# EAGLE design POVDisplayRotate (EAGLE 7.4.0)
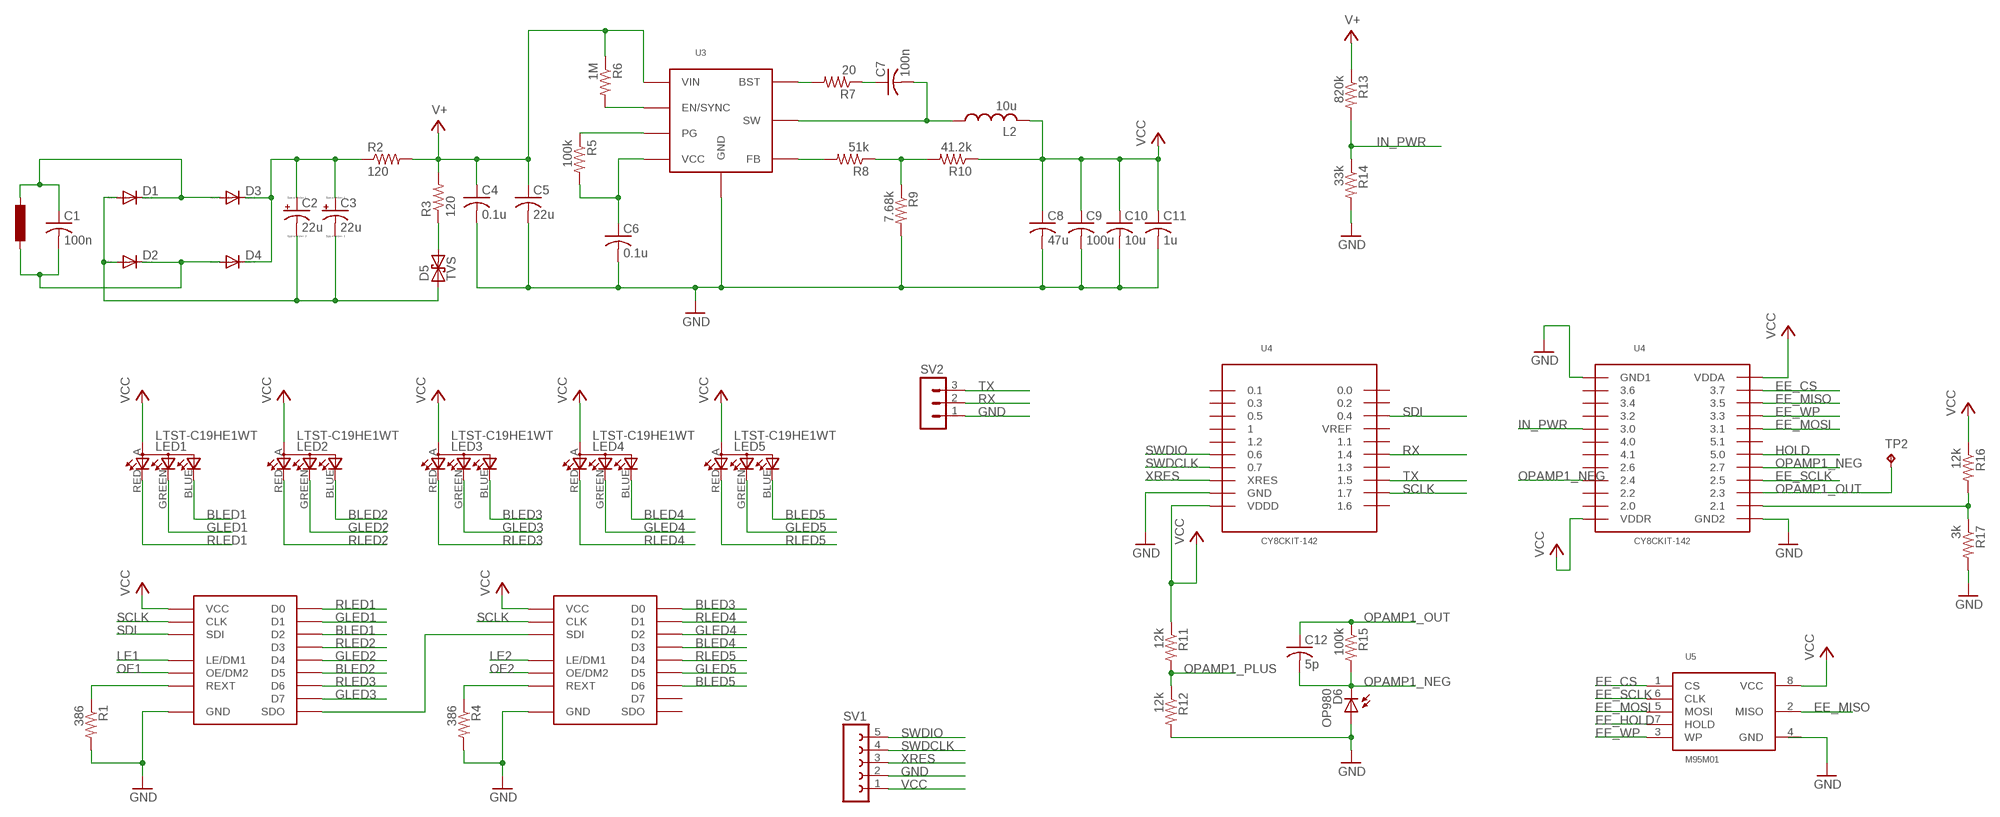
[diagram p0: schematic, sheet 1]

## Parts
C1  100n  C-USC1210  [C1210]
C2  22u  CPOL-USC  [PANASONIC_C]
C3  22u  CPOL-USC  [PANASONIC_C]
C4  0.1u  C-USC0603  [C0603]
C5  22u  C-USC0805  [C0805]
C6  0.1u  C-USC0603  [C0603]
C7  100n  C-USC0603  [C0603]
C8  47u  C-USC0603  [C0603]
C9  100u  C-USC1210  [C1210]
C10  10u  C-USC0603  [C0603]
C11  1u  C-USC0603  [C0603]
C12  5p  C-USC0603  [C0603]
D1  DIODE-SOD123  [SOD123]
D2  DIODE-SOD123  [SOD123]
D3  DIODE-SOD123  [SOD123]
D4  DIODE-SOD123  [SOD123]
D5  TVS  [SMB]
D6  OP980  [PLCC-2]
L2  10u  L-USL1812  [L1812]
LED1  LTST-C19HE1WT  [LTST-C19HE1WT]
LED2  LTST-C19HE1WT  [LTST-C19HE1WT]
LED3  LTST-C19HE1WT  [LTST-C19HE1WT]
LED4  LTST-C19HE1WT  [LTST-C19HE1WT]
LED5  LTST-C19HE1WT  [LTST-C19HE1WT]
R1  386  R-US_R0603  [R0603]
R2  120  R-US_R0603  [R0603]
R3  120  R-US_R0603  [R0603]
R4  386  R-US_R0603  [R0603]
R5  100k  R-US_R0603  [R0603]
R6  1M  R-US_R0603  [R0603]
R7  20  R-US_R0603  [R0603]
R8  51k  R-US_R0603  [R0603]
R9  7.68k  R-US_R0603  [R0603]
R10  41.2k  R-US_R0603  [R0603]
R11  12k  R-US_R0603  [R0603]
R12  12k  R-US_R0603  [R0603]
R13  820k  R-US_R0603  [R0603]
R14  33k  R-US_R0603  [R0603]
R15  100k  R-US_R0603  [R0603]
R16  12k  R-US_R0603  [R0603]
R17  3k  R-US_R0603  [R0603]
SV1  FE05-1  [FE05-1]
SV2  MA03-1  [MA03-1]
TP2  TPB1,27  [B1,27]
U1  STP08DP05  [SSOP16_EPAD]
U2  STP08DP05  [SSOP16_EPAD]
U3  MPQ4420Q  [SOT-23-8]
U4  CY8CKIT-142  [CY8CKIT-142]
U5  M95M01  [SO-08]

## Nets
BLED1: LED1.BLUE(CBLUE) U1.7(D2)
BLED2: LED2.BLUE(CBLUE) U1.10(D5)
BLED3: LED3.BLUE(CBLUE) U2.5(D0)
BLED4: LED4.BLUE(CBLUE) U2.8(D3)
BLED5: LED5.BLUE(CBLUE) U2.11(D6)
DAC_OUT: R16.2 R17.1 U4.2.1
EE_CS: U4.3.7 U5.1(CS)
EE_HOLD: U5.7(HOLD)
EE_MISO: U4.3.5 U5.2(MISO)
EE_MOSI: U4.3.1 U5.5(MOSI)
EE_SCLK: U4.2.5 U5.6(CLK)
EE_WP: U4.3.3 U5.3(WP)
GLED1: LED1.GREEN(CGREEN) U1.6(D1)
GLED2: LED2.GREEN(CGREEN) U1.9(D4)
GLED3: LED3.GREEN(CGREEN) U1.12(D7)
GLED4: LED4.GREEN(CGREEN) U2.7(D2)
GLED5: LED5.GREEN(CGREEN) U2.10(D5)
GND: C4.2 C5.2 C6.2 C8.2 C9.2 C10.2 C11.2 D6.P$1(A) R1.2 R4.2 R9.2 R12.2 R14.2 R17.2 SV1.2 SV2.1 U1.1(GND) U1.GND U2.1(GND) U2.GND U3.4(GND) U4.GND U4.GND1 U4.GND2
HOLD: U4.5.0
IN_PWR: R13.2 R14.1 U4.3.0
LE1: U1.4(LE/DM1)
LE2: U2.4(LE/DM1)
N$1: C6.1 R5.2 U3.7(VCC)
N$2: R6.2 U3.6(EN/SYNC)
N$3: C2.+ C3.+ D3.C D4.C R2.1
N$4: R8.2 U3.8(FB)
N$5: R8.1 R9.1 R10.2
N$6: R1.1 U1.15(REXT)
N$7: R7.2 U3.5(BST)
N$8: C7.1 R7.1
N$10: R4.1 U2.15(REXT)
N$11: D5.C R3.1
N$13: R5.1 U3.1(PG)
N$17: C2.- C3.- D1.A D2.A D5.A
N$18: U1.14(SDO) U2.2(SDI)
NEG_COIL: C1.2 D2.C D4.A
OE1: U1.13(OE/DM2)
OE2: U2.13(OE/DM2)
OPAMP1_NEG: C12.2 D6.P$2(C) R15.2 U4.2.4 U4.2.7
OPAMP1_OUT: C12.1 R15.1 TP2.TP U4.2.3
OPAMP1_PLUS: R11.2 R12.1
POS_COIL: C1.1 D1.C D3.A
RLED1: LED1.RED(CRED) U1.5(D0)
RLED2: LED2.RED(CRED) U1.8(D3)
RLED3: LED3.RED(CRED) U1.11(D6)
RLED4: LED4.RED(CRED) U2.6(D1)
RLED5: LED5.RED(CRED) U2.9(D4)
RX: SV2.2 U4.1.4
SCLK: U1.3(CLK) U2.3(CLK) U4.1.7
SDI: U1.2(SDI) U4.0.4
SWDCLK: SV1.4 U4.0.7
SWDIO: SV1.5 U4.0.6
SWOUT: C7.2 L2.1 U3.3(SW)
TX: SV2.3 U4.1.5
V+: C4.1 C5.1 R2.2 R3.2 R6.1 R13.1 U3.2(VIN)
VCC: C8.1 C9.1 C10.1 C11.1 L2.2 LED1.A LED2.A LED3.A LED4.A LED5.A R10.1 R11.1 R16.1 SV1.1 U1.16(VCC) U2.16(VCC) U4.VDDA U4.VDDD U4.VDDR U5.8(VCC)
XRES: SV1.3 U4.XRES
Unconnected: U2.12(D7) U2.14(SDO) U4.0.0 U4.0.1 U4.0.2 U4.0.3 U4.0.5 U4.1 U4.1.1 U4.1.2 U4.1.3 U4.1.6 U4.2.0 U4.2.2 U4.2.6 U4.3.2 U4.3.4 U4.3.6 U4.4.0 U4.4.1 U4.5.1 U4.VREF

## Power pins joined to a net without a drawn wire
GND: U5.4(GND)

## Library data of the parts
C1 C7-C12 = resistor:C-US: CAPACITOR, American symbol
C2 C3 = resistor:CPOL-US: POLARIZED CAPACITOR, American symbol; DIGIKEY: PCE5022CT-ND
C4 C6 = resistor:C-US: CAPACITOR, American symbol; DIGIKEY: 490-6505-1-ND
C5 = resistor:C-US: CAPACITOR, American symbol; DIGIKEY: 445-14428-1-ND
D1-D4 = diode:DIODE-: DIODE; DIGIKEY: B0540W-FDICT-ND
D5 = NicksParts:TVS; DIGIKEY: 1SMB28CAT3GOSCT-ND
D6 = NicksParts:OP980; DIGIKEY: 365-1908-1-ND
L2 = resistor:L-US: INDUCTOR, American symbol; DIGIKEY: 587-1625-1-ND
LED1-LED5 = NicksParts:LTST-C19HE1WT; DIGIKEY: 160-2162-1-ND
R1-R17 = resistor:R-US_: RESISTOR, American symbol; DIGIKEY: P0.0GCT-ND
SV1 = con-lsta:FE05-1: FEMALE HEADER; OC_FARNELL: unknown; OC_NEWARK: unknown
SV2 = con-lstb:MA03-1: PIN HEADER; OC_FARNELL: unknown; OC_NEWARK: unknown
TP2 = testpad:TP: Test pad
U1 U2 = NicksParts:STP08DP05: Low voltage 8-bit constant current LED sink with full outputs error detection. Up to 20V and 100mA of current per LED; DIGIKEY: 497-6119-1-ND
U3 = NicksParts:MPQ4420Q: High Efficiency 2A, 36V, Synchronous Step Down Converter; DIGIKEY: 1589-1293-1-ND
U4 = NicksParts:CY8CKIT-142: PSoC 4 BLE Kit Connectors: S9189-ND (24 pin) S9188-ND (20 pin)
U5 = NicksParts:M95M01: ST SPI based EEPROM; DIGIKEY: 497-14359-1-ND

## Board
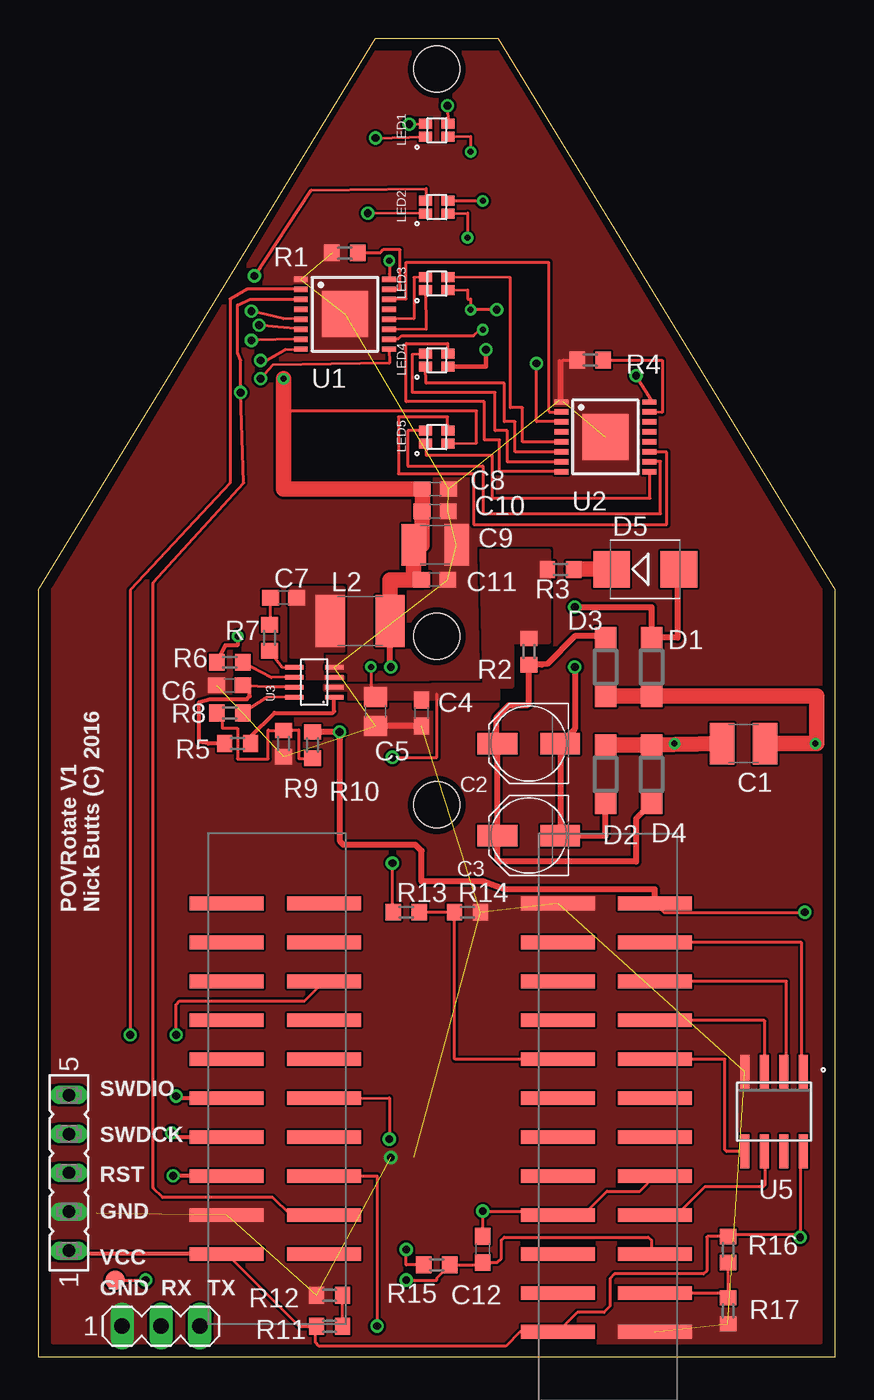
[diagram p1: board, top side]
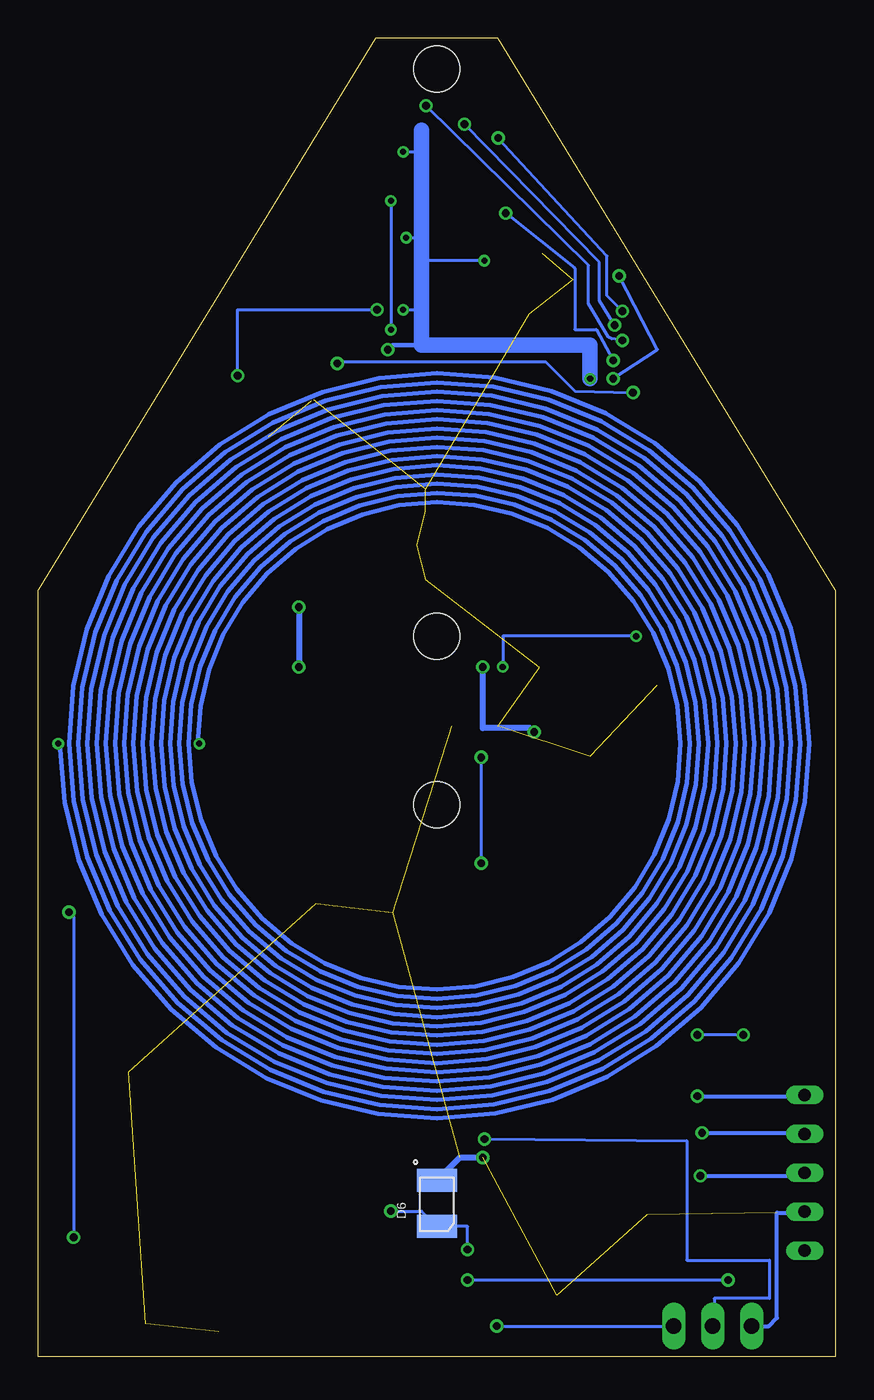
[diagram p2: board, bottom side, seen from below]

Size 52 x 86 mm. Coordinates in mm from the lower left corner, seen from the top.
Outline: 0,0 52,0 52,50 30,86 22,86 0,50 0,0
Copper layers (1*16): Top 0.0356mm / dielectric 1.5011mm / Bottom 0.0356mm
Design rules "oshpark-2layer": minimum track width 6mil, minimum drill 13mil, track to track 6mil, track to pad 6mil, pad to pad 6mil, via to via 6mil, smd to smd 6mil, copper to edge 15mil, drill to drill 6mil, minimum pad ring 7mil, minimum via ring 7mil, stop-mask expansion 4mil, vias tented up to drill 0mil, thermal gap 10mil
Holes 3 mm at 26,47 26,36 26,84

### Footprints (pad centres in the part's own frame; a part is rotated, then mirrored left to right if it is on the bottom)
C1210 = smd 1.6 x 2.7: 1 -1.4,0; 2 1.4,0
PANASONIC_C = smd 2.6 x 1.4: + 2.05,0; - -2.05,0
C0603 = smd 1.1 x 1: 1 -0.85,0; 2 0.85,0
C0805 = smd 1.3 x 1.5: 1 -0.95,0; 2 0.95,0
SOD123 = smd 1.4 x 1.4: A 1.9,0; C -1.9,0
SMB = smd 2.4 x 2.4: A 2.2,0; C -2.2,0
PLCC-2 = smd 1.5 x 2.6: P$1 1.5,0; P$2 -1.5,0
L1812 = smd 1.9 x 3.4: 1 -1.95,0; 2 1.95,0
LTST-C19HE1WT = smd 0.65 x 0.85: A -0.425,-0.725; BLUE 0.425,-0.725; GREEN 0.425,0.725; RED -0.425,0.725
R0603 = smd 1 x 1.1: 1 -0.85,0; 2 0.85,0
FE05-1 = drill 0.813 long: 1 -5.08,0; 2 -2.54,0; 3 0,0; 4 2.54,0; 5 5.08,0
MA03-1 = drill 1.016 long: 1 -2.54,0; 2 0,0; 3 2.54,0
B1,27 = smd 1.27 x 1.27: TP 0,0
SSOP16_EPAD = smd 0.9 x 0.35: 1 -2.875,2.275; 2 -2.875,1.625; 3 -2.875,0.975; 4 -2.875,0.325; 5 -2.875,-0.325; 6 -2.875,-0.975; 7 -2.875,-1.625; 8 -2.875,-2.275; 9 2.875,-2.275; 10 2.875,-1.625; 11 2.875,-0.975; 12 2.875,-0.325; 13 2.875,0.325; 14 2.875,0.975; 15 2.875,1.625; 16 2.875,2.275 | smd 3 x 3: GND 0,0
SOT-23-8 = smd 0.3 x 1.2: 1 -0.975,-1.3; 2 -0.325,-1.3; 3 0.325,-1.3; 4 0.975,-1.3; 5 0.975,1.3; 6 0.325,1.3; 7 -0.325,1.3; 8 -0.975,1.3
CY8CKIT-142 = smd 4.826 x 0.889: 0.0 -7.62,11.43; 0.1 -13.97,11.43; 0.2 -7.62,8.89; 0.3 -13.97,8.89; 0.4 -7.62,6.35; 0.5 -13.97,6.35; 0.6 -13.97,-1.27; 0.7 -13.97,-3.81; 1 -13.97,3.81; 1.1 -7.62,1.27; 1.2 -13.97,1.27; 1.3 -7.62,-3.81; 1.4 -7.62,-1.27; 1.5 -7.62,-6.35; 1.6 -7.62,-11.43; 1.7 -7.62,-8.89; 2.0 7.62,-13.97; 2.1 13.97,-13.97; 2.2 7.62,-11.43; 2.3 13.97,-11.43; 2.4 7.62,-8.89; 2.5 13.97,-8.89; 2.6 7.62,-6.35; 2.7 13.97,-6.35; 3.0 7.62,1.27; 3.1 13.97,1.27; 3.2 7.62,3.81; 3.3 13.97,3.81; 3.4 7.62,6.35; 3.5 13.97,6.35; 3.6 7.62,8.89; 3.7 13.97,8.89; 4.0 7.62,-1.27; 4.1 7.62,-3.81; 5.0 13.97,-3.81; 5.1 13.97,-1.27; GND -13.97,-8.89; GND1 7.62,11.43; GND2 13.97,-16.51; VDDA 13.97,11.43; VDDD -13.97,-11.43; VDDR 7.62,-16.51; VREF -7.62,3.81; XRES -13.97,-6.35
SO-08 = smd 0.6 x 2.2: 1 -1.905,-2.6; 2 -0.635,-2.6; 3 0.635,-2.6; 4 1.905,-2.6; 5 1.905,2.6; 6 0.635,2.6; 7 -0.635,2.6; 8 -1.905,2.6

### Placement (x,y rotation side)
C1  46,40 180 top
C2  32,40 180 top
C3  32,34 180 top
C4  25,42 270 top
C5  22,42.1 270 top
C6  12.49,43.8 180 top
C7  16,49.51 0 top
C8  25.9,56.6 0 top
C9  25.89,52.96 0 top
C10  25.89,55.14 0 top
C11  25.86,50.68 0 top
C12  29,7 90 top
D1  40,45 90 top
D2  37,38 270 top
D3  37,45 270 top
D4  40,38 90 top
D5  39.6,51.37 0 top
D6  26,10 90 bottom
L2  21,48 0 top
LED1  26,80 90 top
LED2  26,75 90 top
LED3  26,70 90 top
LED4  26,65 90 top
LED5  26,60 90 top
R1  20,72 180 top
R2  32,46 90 top
R3  34.07,51.34 180 top
R4  36,65 180 top
R5  13,40 180 top
R6  12.49,45.3 0 top
R7  15.1,46.9 270 top
R8  12.49,42 0 top
R9  16,40 270 top
R10  17.9,39.9 270 top
R11  19,2 0 top
R12  19,4 180 top
R13  24,29 0 top
R14  28,29 0 top
R15  26,6 180 top
R16  45,7 270 top
R17  45,3 270 top
SV1  2,12 90 top
SV2  8,2 0 top
TP2  5,5 0 top
U1  20,68 0 top
U2  37,60 0 top
U3  18,44 90 top
U4  26.27,18.14 0 top
U5  48,16 180 top

### Tracks (layer width: path | path; a pad name or v marks a point on that pad's centre or on a via)
BLED1  (via drill 0.51)
  Top 0.2: U1.7 v13.9,66.3 | v26.7,81.6 LED1.BLUE
  Bottom 0.2: v26.7,81.6 16.1,71.2 16.1,68.7 14.8,66.5 14.6,66.4 v13.9,66.3
BLED2  (via drill 0.4 pad 0.5)
  Top 0.2: LED2.BLUE v29,75.4 | U1.10 22.9,66.4 23.5,66.4 23.7,66.6 28.4,66.6 28.8,67 v29,67
  Bottom 0.2: v29,75.4 v29,67
BLED3
  Top 0.2: U2.5 31.6,59.67 31.6,61.9 30.8,61.9 30.8,70.4 LED3.BLUE
BLED4
  Top 0.2: U2.8 30.1,57.73 30.1,59.8 29.1,59.8 29.1,62.3 24,62.3 24,66.1 26.7,66.1 LED4.BLUE
BLED5
  Top 0.2: LED5.BLUE 26.7,61.3 23.5,61.3 23.5,57.6 28.4,57.6 28.4,54.3 41,54.3 41,59 39.88,59 U2.11
DAC_OUT
  Top 0.2: R16.2 R17.1 44.68,4.17 U4.2.1
EE_CS
  Top 0.2: U5.1 49.8,18.7 49.8,27 49.77,27.03 U4.3.7
EE_MISO
  Top 0.2: U5.2 48.8,18.77 48.8,24.5 40.9,24.5 40.89,24.49 U4.3.5
EE_MOSI
  Top 0.2: U5.5 44.9,13.4 44.8,13.5 44.8,19.4 40.8,19.4 40.79,19.41 U4.3.1
EE_SCLK
  Top 0.2: U5.6 47.4,13.37 47.4,11.2 47.3,11.1 43.5,11.1 41.65,9.25 U4.2.5
EE_WP
  Top 0.2: U5.3 47.4,18.64 47.4,21.9 47.35,21.95 U4.3.3
GLED1  (via drill 0.51)
  Top 0.2: U1.6 15.3,67.2 v14.4,67.3 | v24.2,80.4 LED1.GREEN
  Bottom 0.2: v14.4,67.3 15.4,68.9 15.4,71.4 v24.2,80.4
GLED2  (via drill 0.51)
  Top 0.2: U1.9 22.9,64.8 15.3,64.7 v14.5,63.8 | v14.1,70.5 17.8,76.1 25.3,76.2 LED2.GREEN
  Bottom 0.2: v14.5,63.8 11.6,65.7 v14.1,70.5
GLED3
  Top 0.2: LED3.GREEN 24.5,70.4 24.5,67.7 U1.12
GLED4
  Top 0.2: U2.7 30.6,58.38 30.6,60.4 29.8,60.4 29.8,62.9 24.4,62.9 24.4,65.4 LED4.GREEN
GLED5
  Top 0.2: LED5.GREEN 24.1,60.4 24.1,58.1 29,58.1 29,55 40.6,55 40.6,58.4 39.9,58.4 U2.10 39.88,58.4
GND  (via drill 0.51)  (21 unrouted)
  Top 0.2: R4.2 34.2,65 34.2,62.35 U2.1 34,62.4 34,65
  Top 0.406: C4.2 C5.2
  Bottom 0.254: SV2.1 4.35,2 3.81,2.54 3.81,9.4 2.06,9.4 SV1.2
  Bottom 0.406: D6.P$1 24.5,13 v23,13
  pour Top (no thermals): 38.6,58.4 35.3,58.4 35.3,62.1 33.7,62.1 33.7,62.6 38.5,62.6 38.6,62.5
  pour Top (no thermals): 21.5,66.5 18.5,66.5 18.5,70 16.8,70 16.8,72.5 17.7,72.6 19.7,72.6 19.7,71 21.5,71
  pour Top (rank 6, no thermals): 1,1 51,1 51,50 30,85 22,85 1,50
IN_PWR
  Top 0.2: R13.2 R14.1 27.15,19.45 27.2,19.4 U4.3.0
N$1
  Top 0.2: U3.7 14.8,43.7 C6.1
  Top 0.254: R5.2 11.1,40 10.49,40.1 10.49,42.7 11.2,42.9 13.6,42.9 13.8,43.1 13.8,43.75 C6.1
N$2
  Top 0.2: U3.6 15.2,44.3 R6.2
N$3
  Top 0.406: D3.C 36.9,47 35,47 33.2,45.2 32.85,45.15 R2.1 32,42.6 31.9,42.5 30.7,42.5 29.9,41.7 29.9,40.05 C2.+ C3.+ 29.95,32.45 30.1,32.3 39,32.3 39,35.1 D4.C
N$4
  Top 0.2: U3.8 14.9,43 R8.2
N$5
  Top 0.2: R10.2 17.85,39 17,39 17,40.9 16.95,40.85 R9.1 15.05,40.85 15,40.9 15,39 13,39 13,41 12,41 12,41.85 R8.1
N$6
  Top 0.2: U1.15 23.18,69.62 23.6,69.6 23.6,72.2 22.5,72.2 22.3,72 R1.1
N$7
  Top 0.2: R7.2 15.9,45 U3.5
N$8
  Top 0.2: C7.1 R7.1
N$10
  Top 0.2: R4.1 40.7,65 40.7,61.6 40.27,61.62 U2.15
N$11
  Top 1.016: D5.C 34.95,51.37 R3.1
N$13
  Top 0.254: R5.1 13.85,40.45 15.4,42 19.2,42 19.3,42.1 U3.1
N$17  (via drill 0.51)
  Top 0.406: D2.A 37,34 C3.- C2.- 35,40.95 v35,45 | v35,48.9 40,48.9 D1.A 41.7,46.9 41.7,51.27 D5.A
  Bottom 0.406: v35,48.9 v35,45
N$18
  Top 0.2: 34.1,61.6 U2.2 33.33,61.62 33.3,61.7 33.3,71.4 24,71.4 24,69 23.98,68.97 U1.14
N$19  (via drill 0.4 pad 0.5)
  Bottom 0.3: v41.5,40 41.6,40 41.42,42.44 40.87,44.83 39.94,47.1 38.67,49.2 37.08,51.08 35.22,52.69 33.13,53.99 30.86,54.95 28.46,55.54 26,55.75 23.53,55.57 21.12,55.01 18.83,54.07 16.71,52.79 14.81,51.19 13.19,49.31 11.87,47.2 10.91,44.9 10.31,42.48 10.1,40 10.28,37.51 10.85,35.08 11.79,32.76 13.09,30.62 14.7,28.7 16.6,27.06 18.73,25.74 21.05,24.76 23.49,24.16 26,23.95 28.51,24.13 30.97,24.71 33.31,25.66 35.47,26.97 37.4,28.6 39.06,30.51 40.39,32.67 41.38,35 41.99,37.47 42.2,40 42.02,42.54 41.44,45.02 40.47,47.38 39.16,49.56 37.51,51.51 35.58,53.18 33.4,54.53 31.04,55.52 28.55,56.13 26,56.35 23.44,56.16 20.94,55.58 18.56,54.61 16.35,53.28 14.39,51.61 12.7,49.66 11.34,47.47 10.34,45.09 9.72,42.58 9.5,40 9.69,37.42 10.28,34.89 11.26,32.49 12.6,30.27 14.28,28.28 16.25,26.58 18.46,25.2 20.86,24.19 23.4,23.57 26,23.35 28.61,23.54 31.15,24.14 33.58,25.12 35.82,26.48 37.83,28.17 39.54,30.16 40.93,32.39 41.95,34.82 42.58,37.37 42.8,40 42.61,42.63 42.01,45.2 41.01,47.65 39.64,49.91 37.93,51.93 35.93,53.66 33.67,55.06 31.23,56.09 28.65,56.73 26,56.95 23.35,56.76 20.75,56.15 18.28,55.14 16,53.76 13.96,52.04 12.21,50.02 10.8,47.74 9.77,45.27 9.12,42.67 8.9,40 9.1,37.32 9.71,34.71 10.72,32.22 12.12,29.91 13.86,27.86 15.9,26.09 18.19,24.67 20.68,23.62 23.3,22.98 26,22.75 28.7,22.95 31.34,23.57 33.85,24.59 36.17,26 38.25,27.75 40.03,29.81 41.46,32.12 42.52,34.63 43.17,37.28 43.4,40 43.2,42.72 42.58,45.39 41.54,47.92 40.12,50.26 38.36,52.36 36.28,54.15 33.95,55.6 31.41,56.66 28.74,57.32 26,57.55 23.25,57.35 20.57,56.72 18.01,55.68 15.65,54.25 13.54,52.46 11.73,50.37 10.27,48.02 9.2,45.46 8.53,42.77 8.3,40 8.5,37.23 9.14,34.52 10.19,31.94 11.63,29.56 13.43,27.43 15.54,25.61 17.92,24.14 20.49,23.05 23.21,22.39 26,22.15 28.8,22.36 31.52,23 34.12,24.05 36.53,25.51 38.67,27.32 40.51,29.45 42,31.85 43.09,34.45 43.76,37.19 44,40 43.79,42.82 43.15,45.57 42.08,48.19 40.61,50.62 38.78,52.78 36.63,54.63 34.22,56.13 31.6,57.23 28.84,57.91 26,58.15 23.16,57.94 20.38,57.29 17.74,56.21 15.3,54.73 13.11,52.89 11.24,50.72 9.73,48.29 8.62,45.65 7.94,42.86 7.7,40 7.91,37.13 8.57,34.34 9.65,31.67 11.15,29.21 13.01,27.01 15.19,25.12 17.64,23.6 20.31,22.48 23.12,21.79 26,21.55 28.89,21.76 31.71,22.42 34.4,23.52 36.88,25.02 39.1,26.9 41,29.1 42.53,31.58 43.66,34.26 44.36,37.09 44.6,40 44.39,42.91 43.72,45.76 42.61,48.47 41.1,50.97 39.2,53.2 36.99,55.12 34.49,56.67 31.79,57.8 28.93,58.5 26,58.75 23.06,58.53 20.2,57.86 17.47,56.75 14.94,55.22 12.69,53.31 10.76,51.07 9.2,48.56 8.05,45.83 7.35,42.95 7.1,40 7.32,37.04 8,34.15 9.12,31.4 10.66,28.86 12.58,26.58 14.84,24.64 17.37,23.07 20.12,21.91 23.02,21.2 26,20.95 28.98,21.17 31.9,21.85 34.67,22.99 37.23,24.54 39.52,26.48 41.48,28.75 43.07,31.3 44.23,34.08 44.95,37 45.2,40 44.98,43.01 44.29,45.94 43.15,48.74 41.58,51.32 39.63,53.63 37.34,55.61 34.76,57.2 31.97,58.37 29.02,59.1 26,59.35 22.97,59.13 20.01,58.43 17.2,57.28 14.59,55.7 12.26,53.74 10.27,51.43 8.66,48.83 7.48,46.02 6.75,43.05 6.5,40 6.72,36.95 7.43,33.97 8.59,31.13 10.18,28.5 12.16,26.16 14.48,24.15 17.1,22.53 19.94,21.34 22.93,20.61 26,20.35 29.08,20.58 32.08,21.28 34.94,22.45 37.59,24.05 39.95,26.05 41.97,28.4 43.6,31.03 44.8,33.89 45.54,36.91 45.8,40 45.57,43.1 44.86,46.13 43.68,49.01 42.07,51.67 40.05,54.05 37.69,56.09 35.04,57.74 32.16,58.95 29.12,59.69 26,59.95 22.88,59.72 19.83,59 16.92,57.82 14.24,56.19 11.84,54.16 9.79,51.78 8.13,49.1 6.91,46.2 6.16,43.14 5.9,40 6.13,36.85 6.86,33.78 8.05,30.85 9.69,28.15 11.73,25.73 14.13,23.67 16.83,22 19.75,20.77 22.83,20.01 26,19.75 29.17,19.98 32.27,20.71 35.21,21.92 37.94,23.57 40.37,25.63 42.45,28.04 44.14,30.76 45.37,33.7 46.13,36.81 46.4,40 46.16,43.19 45.43,46.31 44.22,49.28 42.55,52.03 40.48,54.48 38.04,56.58 35.31,58.27 32.34,59.52 29.21,60.28 26,60.55 22.78,60.31 19.64,59.57 16.65,58.35 13.89,56.67 11.42,54.58 9.3,52.13 7.6,49.38 6.34,46.39 5.57,43.24 5.3,40 5.54,36.76 6.29,33.59 7.52,30.58 9.21,27.8 11.31,25.31 13.78,23.18 16.55,21.46 19.57,20.2 22.74,19.42 26,19.15 29.26,19.39 32.45,20.14 35.49,21.38 38.29,23.08 40.8,25.2 42.94,27.69 44.67,30.49 45.94,33.52 46.73,36.72 47,40 46.76,43.29 46,46.5 44.75,49.55 43.04,52.38 40.9,54.9 38.4,57.06 35.58,58.8 32.53,60.09 29.31,60.88 26,61.15 22.69,60.9 19.45,60.14 16.38,58.88 13.53,57.16 10.99,55.01 8.82,52.48 7.06,49.65 5.77,46.57 4.98,43.33 4.7,40 4.95,36.67 5.71,33.41 6.98,30.31 8.72,27.45 10.89,24.89 13.43,22.7 16.28,20.93 19.38,19.63 22.65,18.83 26,18.55 29.36,18.8 32.64,19.57 35.76,20.85 38.64,22.6 41.22,24.78 43.43,27.34 45.21,30.21 46.51,33.33 47.32,36.62 47.6,40 47.35,43.38 46.57,46.68 45.29,49.83 43.52,52.73 41.33,55.33 38.75,57.55 35.85,59.34 32.71,60.66 29.4,61.47 26,61.75 22.59,61.5 19.27,60.71 16.11,59.42 13.18,57.65 10.57,55.43 8.33,52.84 6.53,49.92 5.2,46.76 4.38,43.42 4.1,40 4.36,36.57 5.14,33.22 6.45,30.04 8.23,27.09 10.46,24.46 13.07,22.21 16.01,20.39 19.2,19.06 22.55,18.24 26,17.95 29.45,18.21 32.82,19 36.03,20.31 39,22.11 41.65,24.36 43.91,26.99 45.74,29.94 47.09,33.15 47.91,36.53 48.2,40 47.94,43.48 47.14,46.87 45.82,50.1 44.01,53.08 41.75,55.75 39.1,58.03 36.13,59.87 32.9,61.23 29.49,62.06 26,62.35 22.5,62.09 19.08,61.28 15.83,59.95 12.83,58.13 10.14,55.86 7.85,53.19 5.99,50.19 4.63,46.94 3.79,43.52 3.5,40 3.76,36.48 4.57,33.04 5.91,29.77 7.75,26.74 10.04,24.04 12.72,21.72 15.74,19.86 19.01,18.49 22.46,17.64 26,17.35 29.55,17.61 33.01,18.43 36.3,19.78 39.35,21.63 42.07,23.93 44.4,26.63 46.27,29.67 47.66,32.96 48.51,36.44 48.8,40 48.53,43.57 47.71,47.05 46.35,50.37 44.49,53.44 42.17,56.17 39.45,58.52 36.4,60.41 33.08,61.8 29.59,62.65 26,62.95 22.41,62.68 18.9,61.85 15.56,60.49 12.47,58.62 9.72,56.28 7.36,53.54 5.46,50.47 4.06,47.13 3.2,43.61 2.9,40 3.17,36.38 4,32.85 5.38,29.49 7.26,26.39 9.61,23.61 12.37,21.24 15.46,19.32 18.82,17.92 22.36,17.05 26,16.75 29.64,17.02 33.19,17.86 36.58,19.24 39.7,21.14 42.49,23.51 44.88,26.28 46.81,29.4 48.23,32.78 49.1,36.34 49.4,40 49.13,43.66 48.28,47.24 46.89,50.64 44.98,53.79 42.6,56.6 39.81,59 36.67,60.94 33.27,62.37 29.68,63.24 26,63.55 22.31,63.27 18.71,62.43 15.29,61.02 12.12,59.1 9.29,56.7 6.88,53.9 4.92,50.74 3.49,47.31 2.61,43.7 2.3,40 2.58,36.29 3.43,32.67 4.84,29.22 6.78,26.03 9.19,23.19 12.02,20.75 15.19,18.79 18.64,17.35 22.27,16.46 26,16.15 29.73,16.43 33.38,17.29 36.85,18.71 40.05,20.66 42.92,23.08 45.37,25.93 47.34,29.12 48.8,32.59 49.69,36.25 50,40 49.72,43.76 48.85,47.43 47.42,50.92 45.47,54.14 43.02,57.02 40.16,59.49 36.94,61.48 33.45,62.94 29.78,63.84 26,64.15 22.22,63.87 18.53,63 15.02,61.56 11.77,59.59 8.87,57.13 6.39,54.25 4.39,51.01 2.92,47.5 2.01,43.8 1.7,40 1.98,36.2 2.86,32.48 4.31,28.95 6.29,25.68 8.76,22.76 11.66,20.27 14.92,18.25 18.45,16.77 22.18,15.87 26,15.55 29.83,15.84 33.56,16.72 37.12,18.18 40.41,20.17 43.34,22.66 45.85,25.58 47.88,28.85 49.37,32.41 50.28,36.15 50.6,40 v50.7,40
NEG_COIL
  Top 1.016: C1.2 D4.A D2.C
OPAMP1_NEG  (via drill 0.51)
  Top 0.2: R15.2 24,6 v24,7 | C12.2 v29,9.5 33.64,9.5 U4.2.4 35.55,9.25 37.1,10.8 39.25,10.8 U4.2.7
  Bottom 0.2: 26.5,9 D6.P$2 | v24,7 24,8.5 D6.P$2 | v29,9.5 27,9.5 D6.P$2
OPAMP1_OUT  (via drill 0.51)
  Top 0.2: U4.2.3 40,6.95 40,7.6 39.8,7.8 30.4,7.8 30.2,7.6 30.2,6.4 29.95,6.15 C12.1 28.85,6 R15.1 26,5.15 26,5 v24,5 | TP2.TP v7,5
  Bottom 0.2: v7,5 v24,5
OPAMP1_PLUS
  Top 0.2: R11.2 R12.1
POS_COIL
  Top 1.016: C1.1 50.8,40 50.8,43.1 D1.C D3.A
RLED1  (via drill 0.51)
  Top 0.2: U1.5 16,67.7 v13.9,68.2 | v22,79.5 LED1.RED
  Bottom 0.2: v13.9,68.2 14.9,69.2 14.9,71.8 v22,79.5
RLED2  (via drill 0.51)
  Top 0.2: LED2.RED v21.5,74.6 | v14.5,65 14.9,65 16.1,65.7 U1.8
  Bottom 0.2: v21.5,74.6 17,71 17,67 15.6,67 v14.5,65
RLED3
  Top 0.2: LED3.RED 25.3,67 U1.11
RLED4
  Top 0.2: U2.6 31.1,59.02 31.1,61 30.4,61 30.4,63.5 25.3,63.5 LED4.RED
RLED5
  Top 0.2: LED5.RED 25.3,58.8 29.6,58.8 29.6,56 39.9,56 39.9,57.7 U2.9
RX  (via drill 0.51)
  Top 0.2: U4.1.4 22.9,16.9 v22.9,14.2
  Bottom 0.2: v22.9,14.2 9.7,14.1 9.7,6.3 4.3,6.3 4.3,3.8 7.9,3.8 SV2.2
SCLK  (via drill 0.51)
  Top 0.2: U4.1.7 16.45,9.25 15.3,10.4 8.1,10.4 7.5,11 7.5,50.5 13.4,57 v13.2,62.9 13.2,65 13,65.5 13,68.6 13.82,68.97 U1.3 17.2,69 | U2.3 34.1,61 32.5,61 v32.5,64.8
  Bottom 0.2: v32.5,64.8 32.4,64.9 18.9,64.9 17,63 v13.2,62.9
SDI  (via drill 0.51)
  Top 0.2: U1.2 13.62,69.62 12.5,69 12.5,57 6,50 v6,21 | v9,21 9,23 9.2,23.2 17.36,23.2 U4.0.4
  Bottom 0.2: v6,21 v9,21
SWDCLK  (via drill 0.51)
  Top 0.254: U4.0.7 8.97,14.33 v8.7,14.6
  Bottom 0.254: v8.7,14.6 2.06,14.6 SV1.4
SWDIO  (via drill 0.51)
  Top 0.254: U4.0.6 9.13,16.87 v9,17
  Bottom 0.254: v9,17 2.08,17 SV1.5
SWOUT
  pour Top (no thermals): 19.9,44.2 17.5,44.2 17.5,45.6 16.5,45.6 16.5,50.2 19.9,50.2 19.9,46 18.5,46 18.5,44.4 19.9,44.4
TX  (via drill 0.51)
  Top 0.2: U4.1.5 22.1,11.8 v22.1,2
  Bottom 0.2: v22.1,2 SV2.3
V+  (via drill 0.4 pad 0.5, 0.51)
  Top 0.2: v21.7,45 21.7,43 | R13.1 23.1,29.05 v23.1,32.2 | v23.1,39.1 26,39.1 26,43.2
  Top 0.254: v13,47 13,46.4 12.2,46.4 R6.1
  Bottom 0.2: v13,47 21.7,47 v21.7,45 | v23.1,32.2 v23.1,39.1
  pour Top (no thermals): 18.7,43.8 29.1,43.9 28.9,52.6 33.3,52.6 33.3,46.6 30.9,46.6 30.9,43.7 30,43.7 30,42.9 20.3,42.9 20.3,43.5 18.7,43.5
VCC  (via drill 0.4 pad 0.5, 0.51)
  Top 0.2: LED1.A 28.2,79.6 v28.2,78.6 | LED2.A 28,74.6 v28,73 | LED3.A 28,69.6 28,69 28.2,69 v28.2,68.3 v29.9,68.3 | LED5.A 28.6,59.6 28.6,61.7 16,61.7 16,61.8 | v22.9,71.5 22.9,70.65 U1.16 | 18.1,1.95 18.1,0.9 18.3,0.7 30.5,0.7 31.43,1.63 U4.VDDR 35.16,2.9 36.9,2.9 37.3,3.3 37.3,5.1 37.6,5.4 43.4,5.4 43.6,5.6 43.6,7.8 43.65,7.85 R16.1 45.15,8 49.7,8 | 18.1,1.95 R11.1 | 18.1,1.95 17.06,1.95 U4.VDDD | U2.16 40,62.4 v39,64 | U4.VDDA 40.81,29 v50,29 | U5.8 49.7,13.2 49.7,8 | v49.7,7.8 49.7,8
  Top 0.254: U4.VDDD 2.21,6.71 SV1.1
  Top 0.3: LED4.A 29.2,64.6 v29.2,65.7
  Top 0.406: U4.VDDA 40.21,30.5 30.4,30.5 29,31 25,31 25,33 24.6,33.4 19.9,33.4 19.7,33.6 19.7,40.7 v19.65,40.75 R10.1 | v23,45 22.95,45.05 L2.2
  Top 1.016: L2.2 22.95,50.68 C11.1 24.49,50.68 C9.1 25.04,52.96 C10.1 C8.1 16,56.6 16,61.8 v16,63.8
  Bottom 0.2: v28.2,78.6 27,78.6 | v28,73 27,73 | v28.2,68.3 27,68.3 27,68 | v22.9,71.5 27,71.5 | v29.9,68.3 39,68.3 v39,64 | v29.2,65.7 28.9,66 | v50,29 49.7,28.7 v49.7,7.8
  Bottom 0.3: 28.9,66 27,66
  Bottom 0.406: v19.65,40.75 19.9,41 23,41 v23,45
  Bottom 1.016: v16,63.8 16,66 27,66 27,68 27,71.5 27,73 27,78.6 27,80
XRES  (via drill 0.51)
  Top 0.254: U4.XRES v8.81,11.79 v8.8,11.8
  Bottom 0.254: v8.8,11.8 2.2,11.8 SV1.3

### Text on the board
tNames: POVRotate V1 / Nick Butts (C) 2016 | SWDIO | SWDCK | RST | GND | VCC | GND | RX | TX